# Altium project hlk.PrjPcb
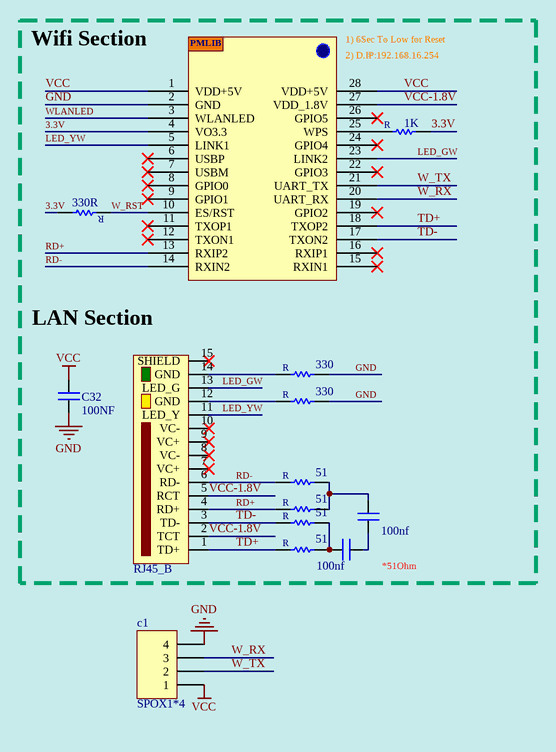
[diagram p0: HLK.SchDoc]
1 sheet, 14 parts. Net scope: global (net labels, ports and power ports of the same name join across sheets).
Board file: hlk-MRL.PcbDoc

## Sheet HLK.SchDoc
size A4

### Parts
3  HLK_WifiModule  [HLK]  (value not drawn)
34  330  [R0805]
35  330R  [R0805]
43  330  [R0805]
89  RJ45_B  [RJ45_B]
c1  SPOX1*4  [SPOX_1*4RIGHT]
C32  100NF  [Cap0805]
C93  100nf  [Cap0805]
C94  100nf  [Cap0805]
PO  51  [R0805]
POS  51  [R0805]
POS2  51  [R0805]
POS3  51  [R0805]
POSWW  1K  [R0805]

### Nets
GND: 3.2(GND) 34.1 43.1 c1.4 C32.1
VCC: 3.1(VDD+5V) 3.28(VDD+5V) c1.1 C32.2
3.3V: 3.4(VO3.3) 35.1 POSWW.1
LED_GW: 3.23(LINK2) 89.13(LED_G)
LED_YW: 3.5(LINK1) 89.11(LED_Y)
RD+: 3.13(RXIP2) 89.4(RD+) POS3.2
RD-: 3.14(RXIN2) 89.6(RD-) POS2.2
TD+: 3.18(TXOP2) 89.1(TD+) PO.2
TD-: 3.17(TXON2) 89.3(TD-) POS.2
VCC-1.8V: 3.27(VDD_1.8V) 89.2(TCT) 89.5(RCT)
W_RST: 3.10(ES/RST) 35.2
W_RX: 3.20(UART_RX) c1.3
W_TX: 3.21(UART_TX) c1.2
WLANLED: 3.3(WLANLED)
Net3_25: 3.25(WPS) POSWW.2
Net34_2: 34.2 89.14(GND)
Net43_2: 43.2 89.12(GND)
NetC93_1: C93.1 C94.1
NetC93_2: C93.2 PO.1 POS.1
NetC94_2: C94.2 POS2.1 POS3.1

Not connected (* = marked no-connect by the designer): 3 6(USBP)* 7(USBM)* 8(GPIO0)* 9(GPIO1)* 11(TXOP1)* 12(TXON1)* 15(RXIN1)* 16(RXIP1)* 19(GPIO2)* 22(GPIO3)* 24(GPIO4)* 26(GPIO5)*; 89 7(VC+)* 8(VC-)* 9(VC+)* 10(VC-)* 15(SHIELD)*

### Notes on the sheet
- (near 3) Wifi Section
- (near 3) 1) 6Sec To Low for Reset
- (near 3) 2) D.IP:192.168.16.254
- LAN Section
- *51Ohm
- Title
- Size:
- Data:
- CompanyName:
- A4
- Number:
- Time:
- Revision:
- Engineer:
- File:
- (in symbol HLK_WifiModule) PMLIB
- (in symbol R0805) R

### Library data of the parts
34 35 43 PO POS POS2 POS3 POSWW = R0805
C32 C93 C94 = Cap0805: surface mount capacitor (size 805)